# EAGLE design WingFly-Shield_v10 (EAGLE 7.5.0)
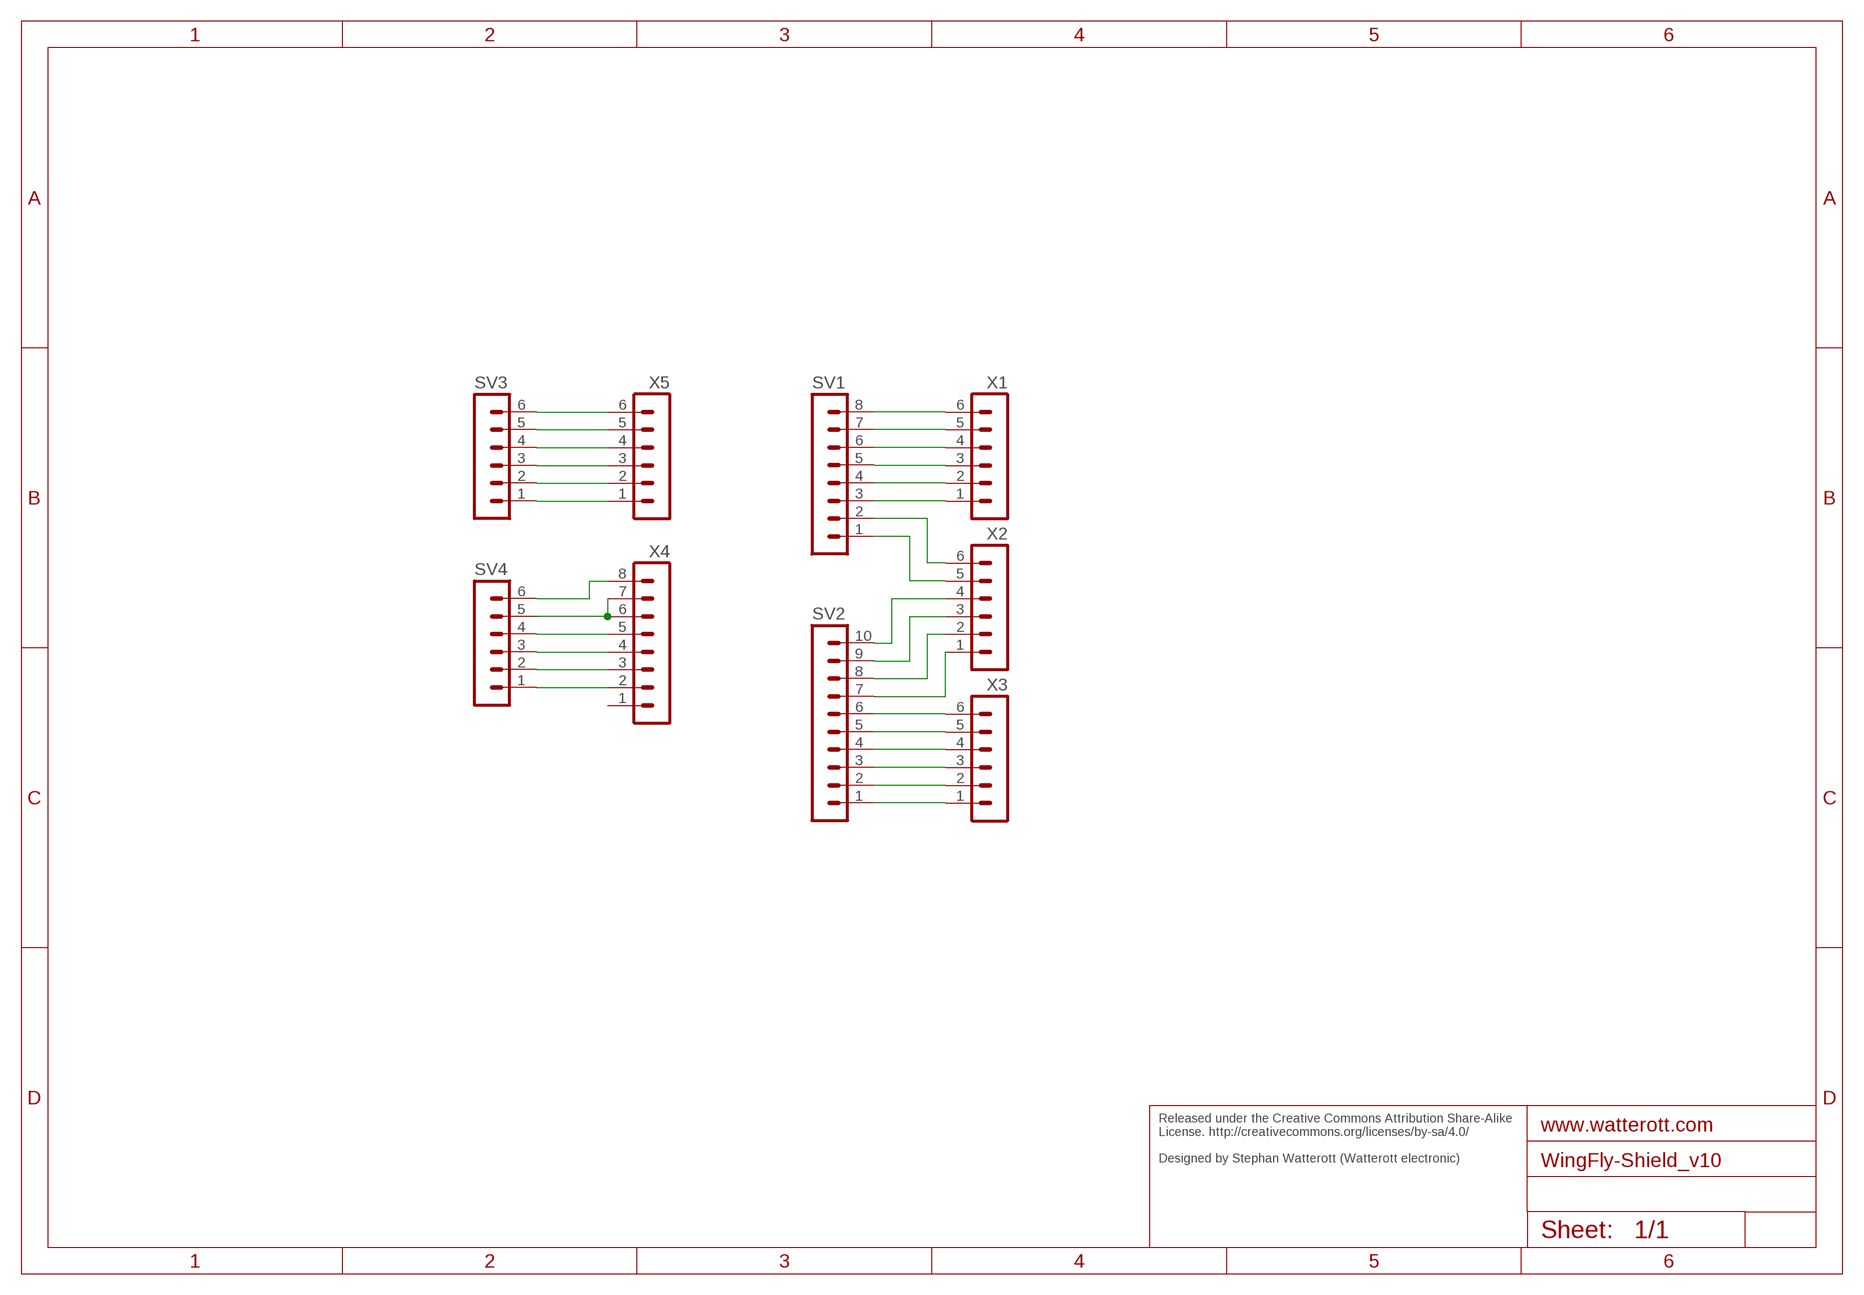
[diagram p0: schematic, sheet 1]

## Parts
SV1  MA08-1  [MA08-1]
SV2  MA10-1  [MA10-1]
SV3  MA06-1  [MA06-1]
SV4  MA06-1  [MA06-1]
X1  MA06-1  [MA06-1]
X2  MA06-1  [MA06-1]
X3  MA06-1  [MA06-1]
X4  MA08-1  [MA08-1]
X5  MA06-1  [MA06-1]

## Nets
3V3: SV4.3 X4.4
5V: SV4.4 X4.5
A0: SV3.1 X5.1
A1: SV3.2 X5.2
A2: SV3.3 X5.3
A3: SV3.4 X5.4
A4: SV3.5 X5.5
A5: SV3.6 X5.6
AREF: SV2.3 X3.3
D0: SV1.8 X1.6
D1: SV1.7 X1.5
D2: SV1.6 X1.4
D3: SV1.5 X1.3
D4: SV1.4 X1.2
D5: SV1.3 X1.1
D6: SV1.2 X2.6
D7: SV1.1 X2.5
D8: SV2.10 X2.4
D9: SV2.9 X2.3
D10: SV2.8 X2.2
D11: SV2.7 X2.1
D12: SV2.6 X3.6
D13: SV2.5 X3.5
GND: SV4.5 X4.6 X4.7
GND2: SV2.4 X3.4
IOREF: SV4.1 X4.2
RST: SV4.2 X4.3
SCL: SV2.1 X3.1
SDA: SV2.2 X3.2
VIN: SV4.6 X4.8
Unconnected: X4.1

## Notes on the sheet
- Released under the Creative Commons Attribution Share-Alike 
  License. http://creativecommons.org/licenses/by-sa/4.0/
  
  Designed by Stephan Watterott (Watterott electronic)

## Library data of the parts
SV1 X4 = con-lstb:MA08-1: PIN HEADER; OC_FARNELL: unknown; OC_NEWARK: unknown
SV2 = con-lstb:MA10-1: PIN HEADER; OC_FARNELL: unknown; OC_NEWARK: unknown
SV3 SV4 X1-X3 X5 = con-lstb:MA06-1: PIN HEADER; OC_FARNELL: unknown; OC_NEWARK: unknown

## Board
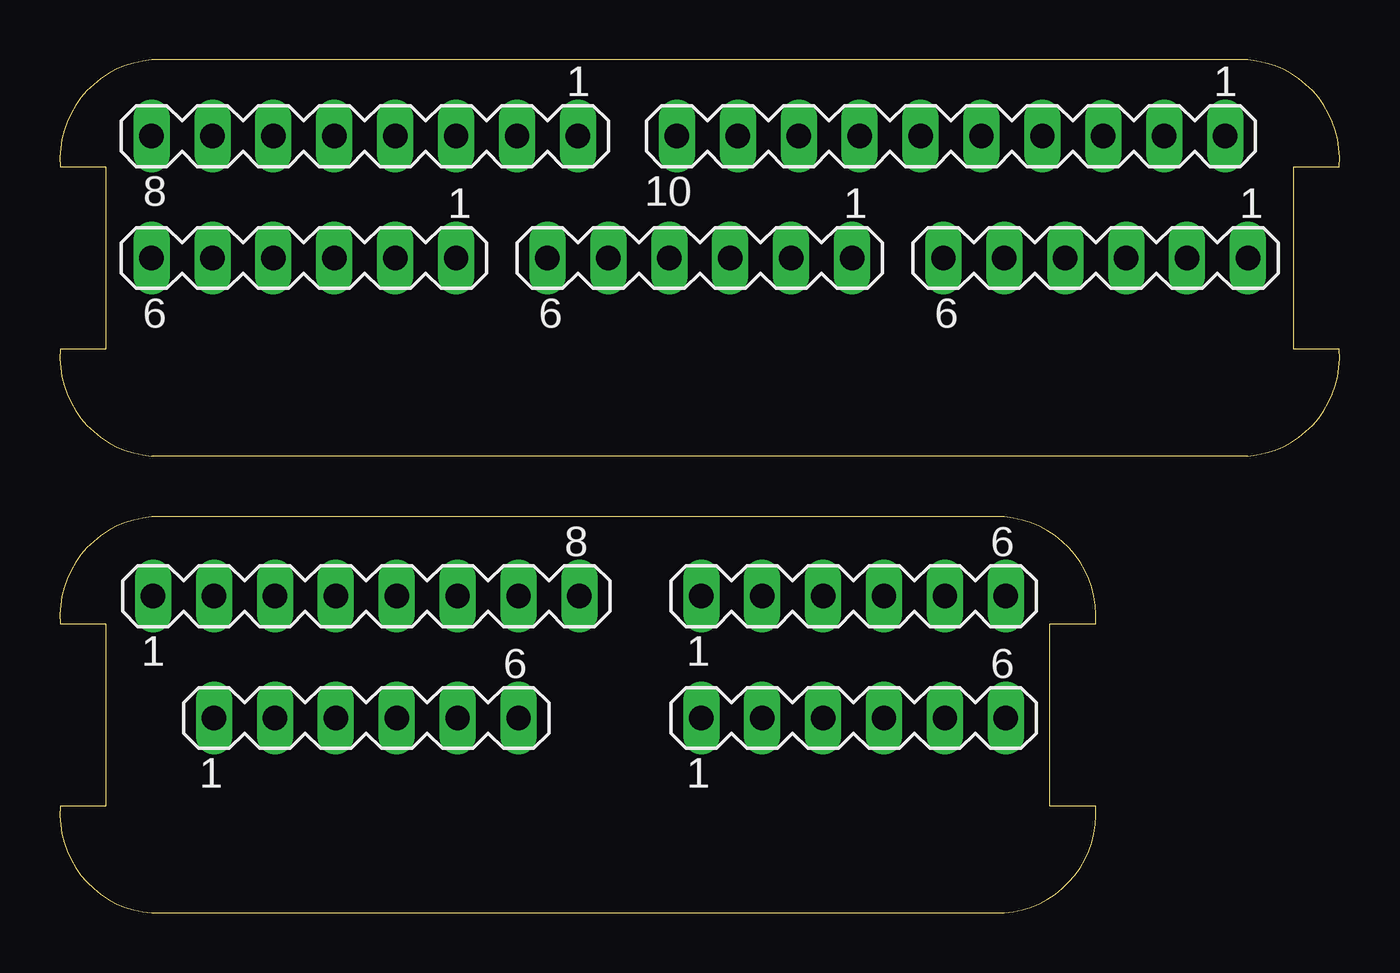
[diagram p1: board, top side]
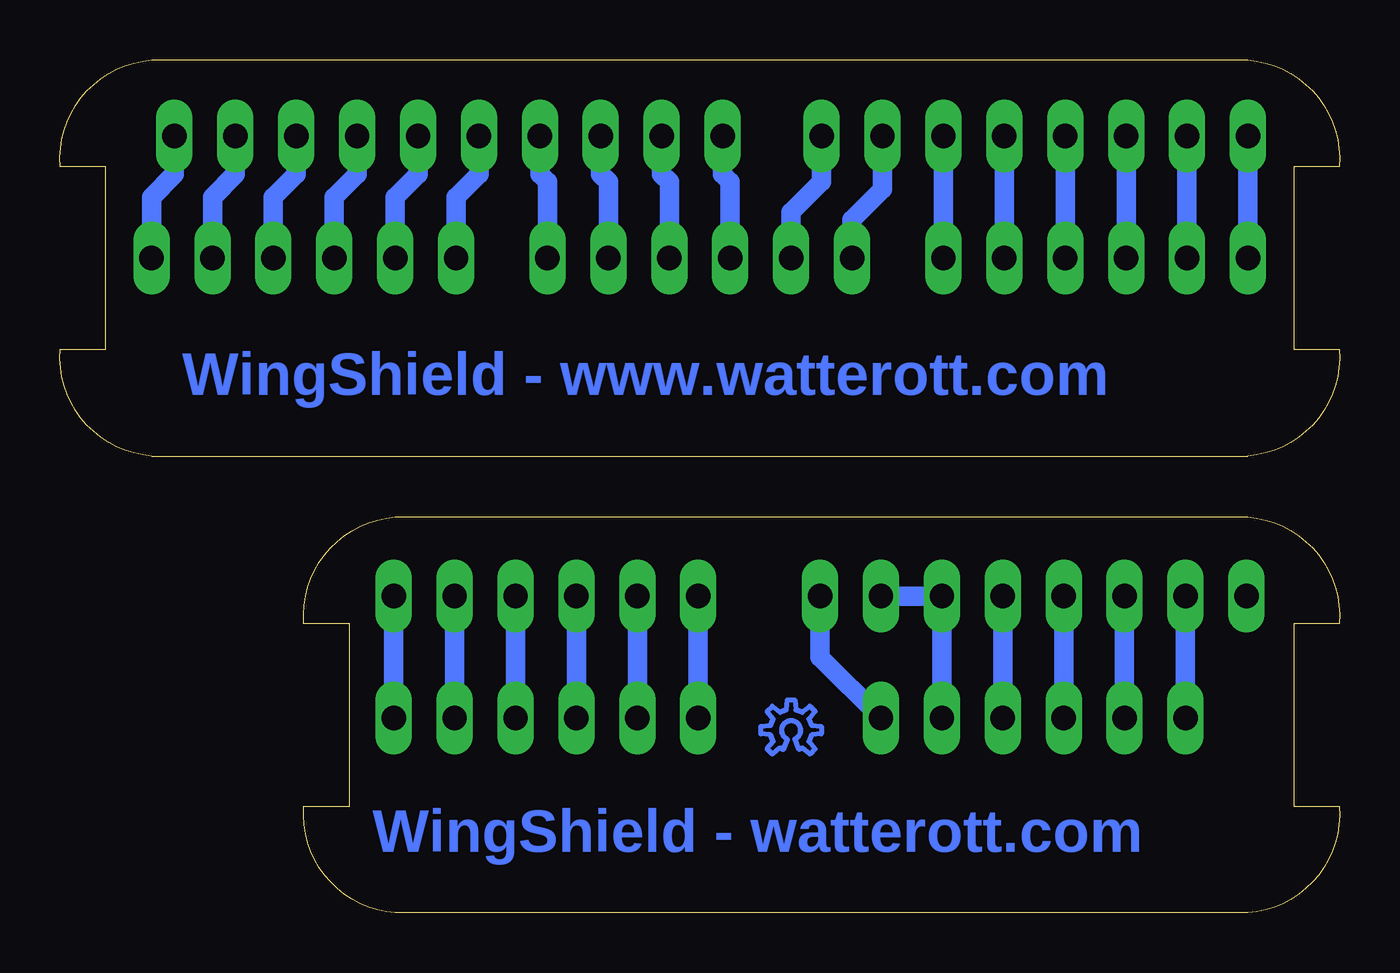
[diagram p2: board, bottom side, seen from below]

Size 53.36 x 35.56 mm. Coordinates in mm from the lower left corner, seen from the top.
Outline: 3.82,35.56 arc90 0.01,31.11 1.92,31.11 1.92,23.5 0.01,23.5 arc90 3.82,19.05 49.54,19.05 arc90 53.35,23.5 51.45,23.5 51.45,31.11 53.35,31.11 arc90 49.54,35.56 3.82,35.56
Outline: 3.82,16.51 arc90 0.01,12.06 1.92,12.06 1.92,4.45 0.01,4.45 arc90 3.82,0 39.38,0 arc90 43.19,4.45 41.29,4.45 41.29,12.06 43.19,12.06 arc90 39.38,16.51 3.82,16.51
Copper layers (1*16): Top 0.035mm / dielectric 1.5mm / Bottom 0.035mm
Design rules "default *": minimum track width 8mil, minimum drill 0.3mm, track to track 8mil, track to pad 8mil, pad to pad 8mil, via to via 8mil, smd to smd 8mil, copper to edge 40mil, drill to drill 8mil, minimum pad ring 10mil, minimum via ring 8mil, stop-mask expansion 4mil, vias tented up to drill 0.5mm, thermal gap 10mil

### Footprints (pad centres in the part's own frame; a part is rotated, then mirrored left to right if it is on the bottom)
MA08-1 = drill 1.016 long: 1 -8.89,0; 2 -6.35,0; 3 -3.81,0; 4 -1.27,0; 5 1.27,0; 6 3.81,0; 7 6.35,0; 8 8.89,0
MA10-1 = drill 1.016 long: 1 -11.43,0; 2 -8.89,0; 3 -6.35,0; 4 -3.81,0; 5 -1.27,0; 6 1.27,0; 7 3.81,0; 8 6.35,0; 9 8.89,0; 10 11.43,0
MA06-1 = drill 1.016 long: 1 -6.35,0; 2 -3.81,0; 3 -1.27,0; 4 1.27,0; 5 3.81,0; 6 6.35,0

### Placement (x,y rotation side)
SV1  12.71,32.38 180 top
SV2  37.16,32.38 180 top
SV3  33.1,8.13 0 top
SV4  12.78,8.13 0 top
X1  10.17,27.3 180 top
X2  26.68,27.3 180 top
X3  43.19,27.3 180 top
X4  12.78,13.21 0 top
X5  33.1,13.21 0 top

### Tracks (layer width: path | path; a pad name or v marks a point on that pad's centre or on a via)
3V3
  Bottom 0.813: X4.4 SV4.3
5V
  Bottom 0.813: X4.5 SV4.4
A0
  Bottom 0.813: X5.1 SV3.1
A1
  Bottom 0.813: X5.2 SV3.2
A2
  Bottom 0.813: X5.3 SV3.3
A3
  Bottom 0.813: X5.4 SV3.4
A4
  Bottom 0.813: X5.5 SV3.5
A5
  Bottom 0.813: X5.6 SV3.6
AREF
  Bottom 0.813: SV2.3 43.51,30.8 44.46,29.84 X3.3
D0
  Bottom 0.813: SV1.8 X1.6
D1
  Bottom 0.813: SV1.7 X1.5
D2
  Bottom 0.813: SV1.6 X1.4
D3
  Bottom 0.813: SV1.5 X1.3
D4
  Bottom 0.813: SV1.4 X1.2
D5
  Bottom 0.813: SV1.3 X1.1
D6
  Bottom 0.813: SV1.2 19.06,30.16 20.33,28.89 X2.6
D7
  Bottom 0.813: SV1.1 21.6,30.48 22.87,29.21 X2.5
D8
  Bottom 0.813: SV2.10 25.73,30.8 25.41,30.48 X2.4
D9
  Bottom 0.813: SV2.9 28.27,30.8 27.95,30.48 X2.3
D10
  Bottom 0.813: SV2.8 30.81,30.8 30.49,30.48 X2.2
D11
  Bottom 0.813: SV2.7 33.35,30.8 33.03,30.48 X2.1
D12
  Bottom 0.813: SV2.6 35.89,30.8 36.84,29.84 X3.6
D13
  Bottom 0.813: SV2.5 38.43,30.8 39.38,29.84 X3.5
GND
  Bottom 0.813: SV4.5 X4.6 X4.7
GND2
  Bottom 0.813: SV2.4 40.97,30.8 41.92,29.84 X3.4
IOREF
  Bottom 0.813: X4.2 SV4.1
RST
  Bottom 0.813: X4.3 SV4.2
S$1
  Bottom 0.203: 23.21,6.81 arc9 23.33,6.88 23.65,6.62 23.87,6.84 23.61,7.16 arc19 23.72,7.42 24.13,7.46 24.13,7.78 23.72,7.82 arc19 23.61,8.08 23.87,8.4 23.65,8.62 23.33,8.36 arc19 23.07,8.47 23.03,8.88 22.72,8.88 22.68,8.47 arc19 22.41,8.36 22.09,8.62 21.87,8.4 22.13,8.08 arc19 22.02,7.82 21.61,7.78 21.61,7.46 22.02,7.42 arc19 22.13,7.16 21.87,6.84 22.09,6.62 22.41,6.88 arc9 22.54,6.81 22.72,7.25 arc-68 22.47,7.62 arc-247 23.02,7.25 23.21,6.81
SCL
  Bottom 0.813: SV2.1 48.59,30.8 49.54,29.84 X3.1
SDA
  Bottom 0.813: SV2.2 46.05,30.8 47,29.84 X3.2
VIN
  Bottom 0.813: X4.8 21.67,10.67 SV4.6

### Text on the board
Bottom: WingShield - www.watterott.com | WingShield - watterott.com
Reference: Silkscreen: 51 tDocu
tDocu: --- Digital --- | 0 | 1 | 2 | 3 | 4 | 5 | 6 | 7 | 8 | 9 | 10 | 11 | 12 | 13 | GND | ARef | SDA | SCL | --- Analog --- | IORef | RST | 3V3 | 5V | GND | Vin | 0 | 1 | 2 | 3 | 4 | 5